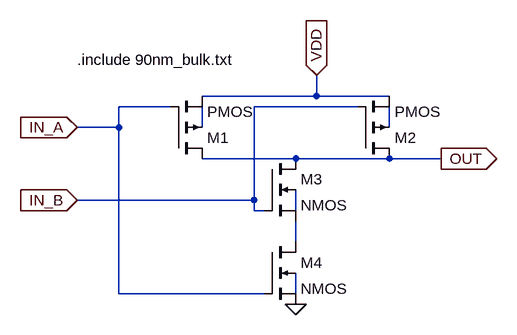
[diagram p0: schematic nand.asc]
nand.asc, the LTspice schematic file:
Version 4
SHEET 1 880 680
WIRE 256 64 256 32
WIRE 256 64 80 64
WIRE 368 64 256 64
WIRE 32 80 -48 80
WIRE 320 80 160 80
WIRE -48 112 -48 80
WIRE -48 112 -112 112
WIRE 80 112 80 80
WIRE 368 112 368 80
WIRE 224 160 80 160
WIRE 368 160 224 160
WIRE 448 160 368 160
WIRE 160 224 160 80
WIRE 160 224 -112 224
WIRE 160 240 160 224
WIRE 176 240 160 240
WIRE 224 240 224 208
WIRE 224 288 224 256
WIRE -48 368 -48 112
WIRE 176 368 -48 368
WIRE 224 368 224 336
FLAG -112 112 IN_A
IOPIN -112 112 In
FLAG 224 384 0
FLAG 256 32 VDD
IOPIN 256 32 In
FLAG -112 224 IN_B
IOPIN -112 224 In
FLAG 448 160 OUT
IOPIN 448 160 Out
SYMBOL pmos4 32 160 M180
SYMATTR InstName M1
SYMATTR Value2 l=90n w=400n
SYMBOL pmos4 320 160 M180
SYMATTR InstName M2
SYMATTR Value2 l=90n w=400n
SYMBOL nmos4 176 160 R0
SYMATTR InstName M3
SYMATTR Value2 l=90n w=200n
SYMBOL nmos4 176 288 R0
SYMATTR InstName M4
SYMATTR Value2 l=90n w=200n
TEXT -112 8 Left 2 !.include 90nm_bulk.txt

The netlist it stands for:
* nand.asc
M1 OUT IN_A VDD N001 PMOS l=90n w=400n
M2 OUT IN_B VDD N002 PMOS l=90n w=400n
M3 OUT IN_B N004 N003 NMOS l=90n w=200n
M4 N004 IN_A 0 N005 NMOS l=90n w=200n
.model NMOS NMOS
.model PMOS PMOS
.lib standard.mos
.include 90nm_bulk.txt
.backanno
.end